# Altium schematic sheet 2_Topology.SchDoc: OBDH Topology
size A3; DrawnBy: André M. P. Mattos; Engineer: Eng_2_ALT; Revision: V0.0; SheetNumber: 2; SheetTotal: 7
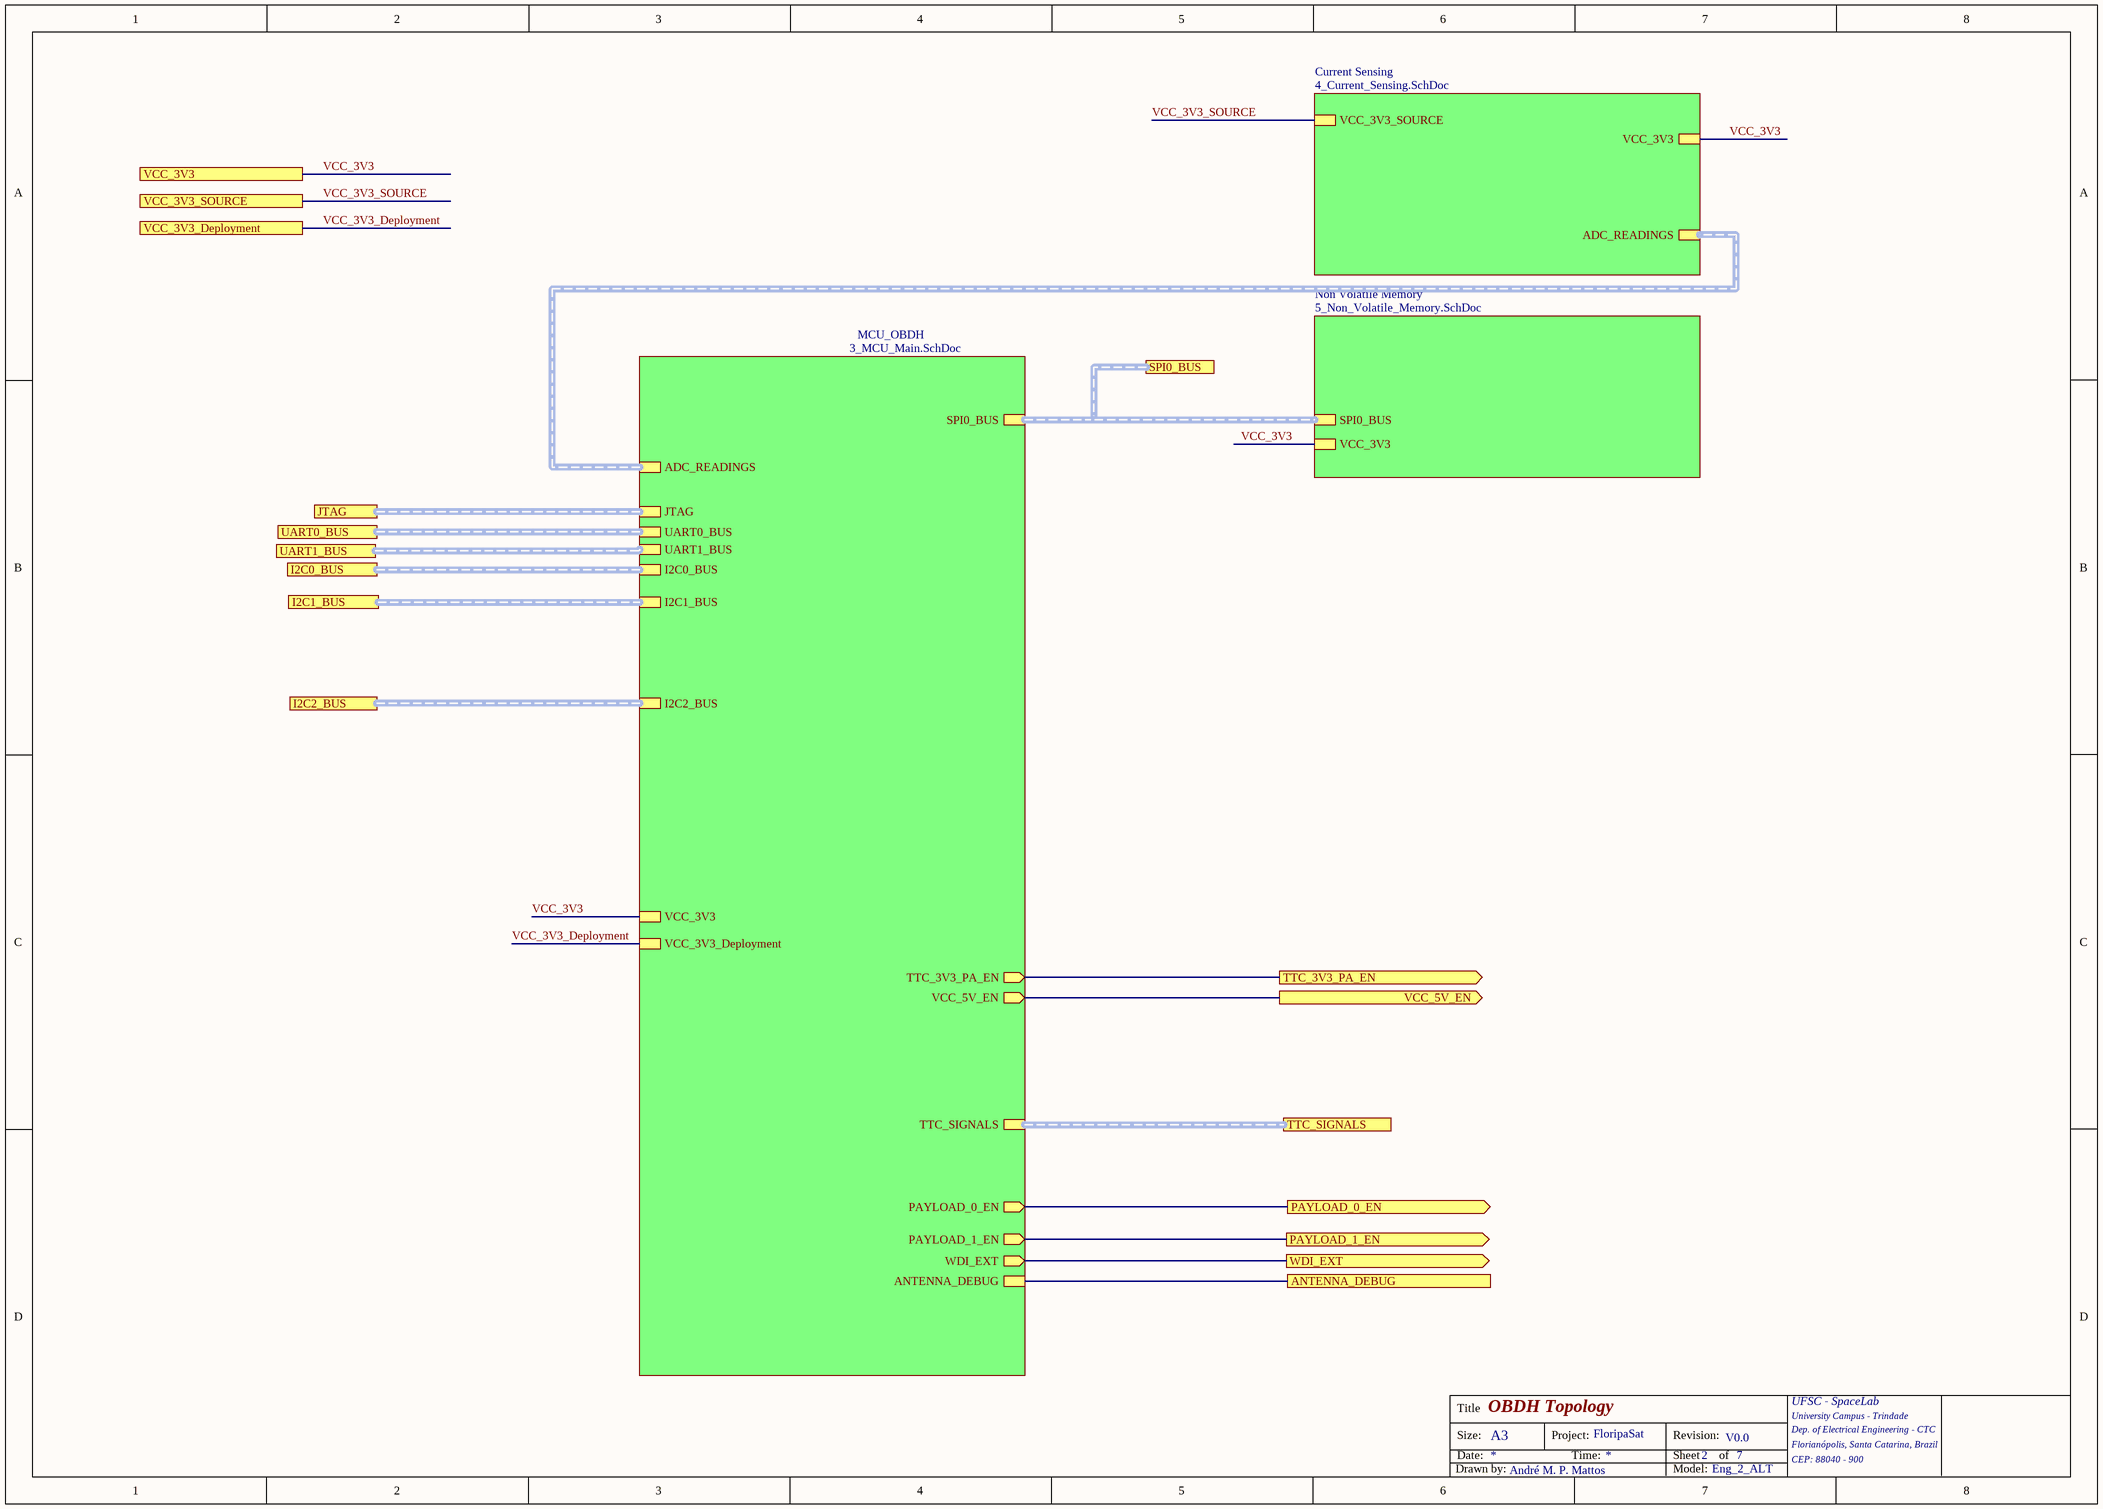
[diagram p0: 2_Topology.SchDoc]

## Sub-sheets
Current Sensing = 4_Current_Sensing.SchDoc: VCC_3V3, ADC_READINGS (harness ADC_READINGS), VCC_3V3_SOURCE
MCU_OBDH = 3_MCU_Main.SchDoc: JTAG (harness JTAG), UART0_BUS (harness UART0_BUS), VCC_3V3, TTC_3V3_PA_EN (out), PAYLOAD_0_EN (out), VCC_5V_EN (out), TTC_SIGNALS (harness TTC_SIGNALS), ADC_READINGS (harness ADC_READINGS), PAYLOAD_1_EN (out), WDI_EXT (out), I2C2_BUS (harness I2C2_BUS), I2C0_BUS (harness I2C0_BUS), ANTENNA_DEBUG, VCC_3V3_Deployment, UART1_BUS (harness UART1_BUS), SPI0_BUS (harness SPI0_BUS), I2C1_BUS (harness I2C1_BUS)
Non Volatile Memory = 5_Non_Volatile_Memory.SchDoc: VCC_3V3, SPI0_BUS (harness SPI0_BUS)

## Ports
ANTENNA_DEBUG, I2C0_BUS (harness I2C0_BUS), I2C1_BUS (harness I2C0_BUS), I2C2_BUS (harness I2C2_BUS), JTAG (harness JTAG), PAYLOAD_0_EN (out), PAYLOAD_1_EN (out), SPI0_BUS (harness SPI0_BUS), TTC_3V3_PA_EN (out), TTC_SIGNALS (harness TTC_SIGNALS), UART0_BUS (harness UART0_BUS), UART1_BUS (harness UART0_BUS), VCC_3V3, VCC_3V3_Deployment, VCC_3V3_SOURCE, VCC_5V_EN (out), WDI_EXT (out)

## Nets
ANTENNA_DEBUG: port ANTENNA_DEBUG, sheet MCU_OBDH/ANTENNA_DEBUG
PAYLOAD_0_EN: port PAYLOAD_0_EN, sheet MCU_OBDH/PAYLOAD_0_EN
PAYLOAD_1_EN: port PAYLOAD_1_EN, sheet MCU_OBDH/PAYLOAD_1_EN
TTC_3V3_PA_EN: port TTC_3V3_PA_EN, sheet MCU_OBDH/TTC_3V3_PA_EN
VCC_3V3: port VCC_3V3, sheet MCU_OBDH/VCC_3V3, sheet Current Sensing/VCC_3V3, sheet Non Volatile Memory/VCC_3V3
VCC_3V3_Deployment: port VCC_3V3_Deployment, sheet MCU_OBDH/VCC_3V3_Deployment
VCC_3V3_SOURCE: port VCC_3V3_SOURCE, sheet Current Sensing/VCC_3V3_SOURCE
VCC_5V_EN: port VCC_5V_EN, sheet MCU_OBDH/VCC_5V_EN
WDI_EXT: port WDI_EXT, sheet MCU_OBDH/WDI_EXT

## Buses and harness runs
harness port I2C0_BUS = sheet MCU_OBDH/I2C0_BUS
harness port I2C1_BUS = sheet MCU_OBDH/I2C1_BUS
harness port I2C2_BUS = sheet MCU_OBDH/I2C2_BUS
harness port JTAG = sheet MCU_OBDH/JTAG
harness port SPI0_BUS = sheet MCU_OBDH/SPI0_BUS = sheet Non Volatile Memory/SPI0_BUS
harness port TTC_SIGNALS = sheet MCU_OBDH/TTC_SIGNALS
harness port UART0_BUS = sheet MCU_OBDH/UART0_BUS
harness port UART1_BUS = sheet MCU_OBDH/UART1_BUS
harness sheet Current Sensing/ADC_READINGS = sheet MCU_OBDH/ADC_READINGS

## Notes on the sheet
- Title
- Size:
- Date:
- A3
- Project:
- Time:
- FloripaSat
- Revision:
- Sheet
- of
- UFSC - SpaceLab
- University Campus - Trindade
- Dep. of Electrical Engineering - CTC
- Florianópolis, Santa Catarina, Brazil
- CEP: 88040 - 900
- Drawn by:
- Model: